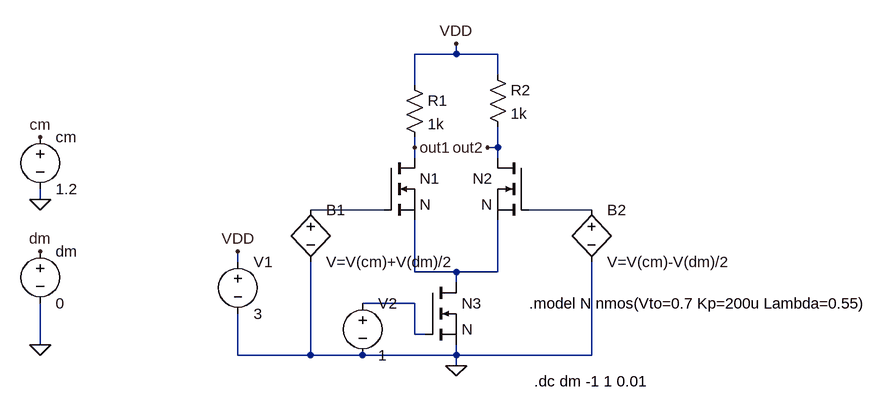
[diagram p0: schematic diff.asc]
diff.asc, the LTspice schematic file:
Version 4.1
SHEET 1 892 680
WIRE 208 -16 208 -32
WIRE 208 -16 144 -16
WIRE 272 -16 208 -16
WIRE 272 16 272 -16
WIRE 144 32 144 -16
WIRE 144 128 144 112
WIRE 272 128 272 96
WIRE 272 128 256 128
WIRE 144 144 144 128
WIRE 272 144 272 128
WIRE -432 208 -432 192
WIRE 96 224 -16 224
WIRE 416 224 320 224
WIRE -128 304 -128 288
WIRE 144 320 144 240
WIRE 208 320 144 320
WIRE 272 320 272 240
WIRE 272 320 208 320
WIRE 208 336 208 320
WIRE 144 368 64 368
WIRE 144 416 144 368
WIRE 160 416 144 416
WIRE -432 432 -432 368
WIRE -128 448 -128 384
WIRE -16 448 -16 304
WIRE -16 448 -128 448
WIRE 64 448 -16 448
WIRE 208 448 208 432
WIRE 208 448 64 448
WIRE 416 448 416 304
WIRE 416 448 208 448
WIRE 208 464 208 448
FLAG 208 464 0
FLAG -128 288 VDD
FLAG 208 -32 VDD
FLAG 144 128 out1
FLAG 256 128 out2
FLAG -432 112 cm
FLAG -432 288 dm
FLAG -432 208 0
FLAG -432 432 0
SYMBOL voltage -128 288 R0
WINDOW 123 0 0 Left 0
WINDOW 39 0 0 Left 0
SYMATTR InstName V1
SYMATTR Value 3
SYMBOL res 128 16 R0
SYMATTR InstName R1
SYMATTR Value 1k
SYMBOL res 256 0 R0
SYMATTR InstName R2
SYMATTR Value 1k
SYMBOL nmos 96 144 R0
SYMATTR InstName N1
SYMATTR Value N
SYMBOL nmos 320 144 M0
SYMATTR InstName N2
SYMATTR Value N
SYMBOL nmos 160 336 R0
SYMATTR InstName N3
SYMATTR Value N
SYMBOL voltage 64 352 R0
WINDOW 123 0 0 Left 0
WINDOW 39 0 0 Left 0
SYMATTR InstName V2
SYMATTR Value 1
SYMBOL voltage -432 96 R0
WINDOW 123 0 0 Left 0
WINDOW 39 0 0 Left 0
SYMATTR InstName cm
SYMATTR Value 1.2
SYMBOL voltage -432 272 R0
WINDOW 123 0 0 Left 0
WINDOW 39 0 0 Left 0
SYMATTR InstName dm
SYMATTR Value 0
SYMBOL bv -16 208 R0
SYMATTR InstName B1
SYMATTR Value V=V(cm)+V(dm)/2
SYMBOL bv 416 208 R0
SYMATTR InstName B2
SYMATTR Value V=V(cm)-V(dm)/2
TEXT 320 368 Left 2 !.model N nmos(Vto=0.7 Kp=200u Lambda=0.55)
TEXT 328 488 Left 2 !.dc dm -1 1 0.01

The netlist it stands for:
* diff.asc
V1 VDD 0 3
R1 VDD out1 1k
R2 VDD out2 1k
M§N1 out1 N001 N003 N003 N
M§N2 out2 N002 N003 N003 N
M§N3 N003 N004 0 0 N
V2 N004 0 1
V§cm cm 0 1.2
V§dm dm 0 0
B1 N001 0 V=V(cm)+V(dm)/2
B2 N002 0 V=V(cm)-V(dm)/2
.model NMOS NMOS
.model PMOS PMOS
.lib standard.mos
.model N nmos(Vto=0.7 Kp=200u Lambda=0.55)
.dc dm -1 1 0.01
.backanno
.end

* Results of the author's LTspice run, read from the files saved beside the schematic
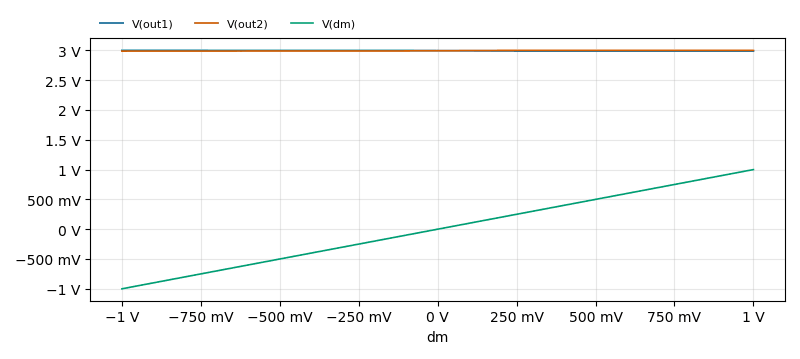
[diagram p1: DC transfer characteristic of diff.asc, plotted from the saved traces]
* DC transfer characteristic, 1 run:
*   V(out1): 3 V at dm=-1 V, 2.987 V at dm=1 V, min 2.987 V, max 3 V
*   V(out2): 2.987 V at dm=-1 V, 3 V at dm=1 V, min 2.987 V, max 3 V
*   V(dm): -1 V at dm=-1 V, 1 V at dm=1 V, min -1 V, max 1 V